# EAGLE design M7050E (EAGLE 6.6.0)
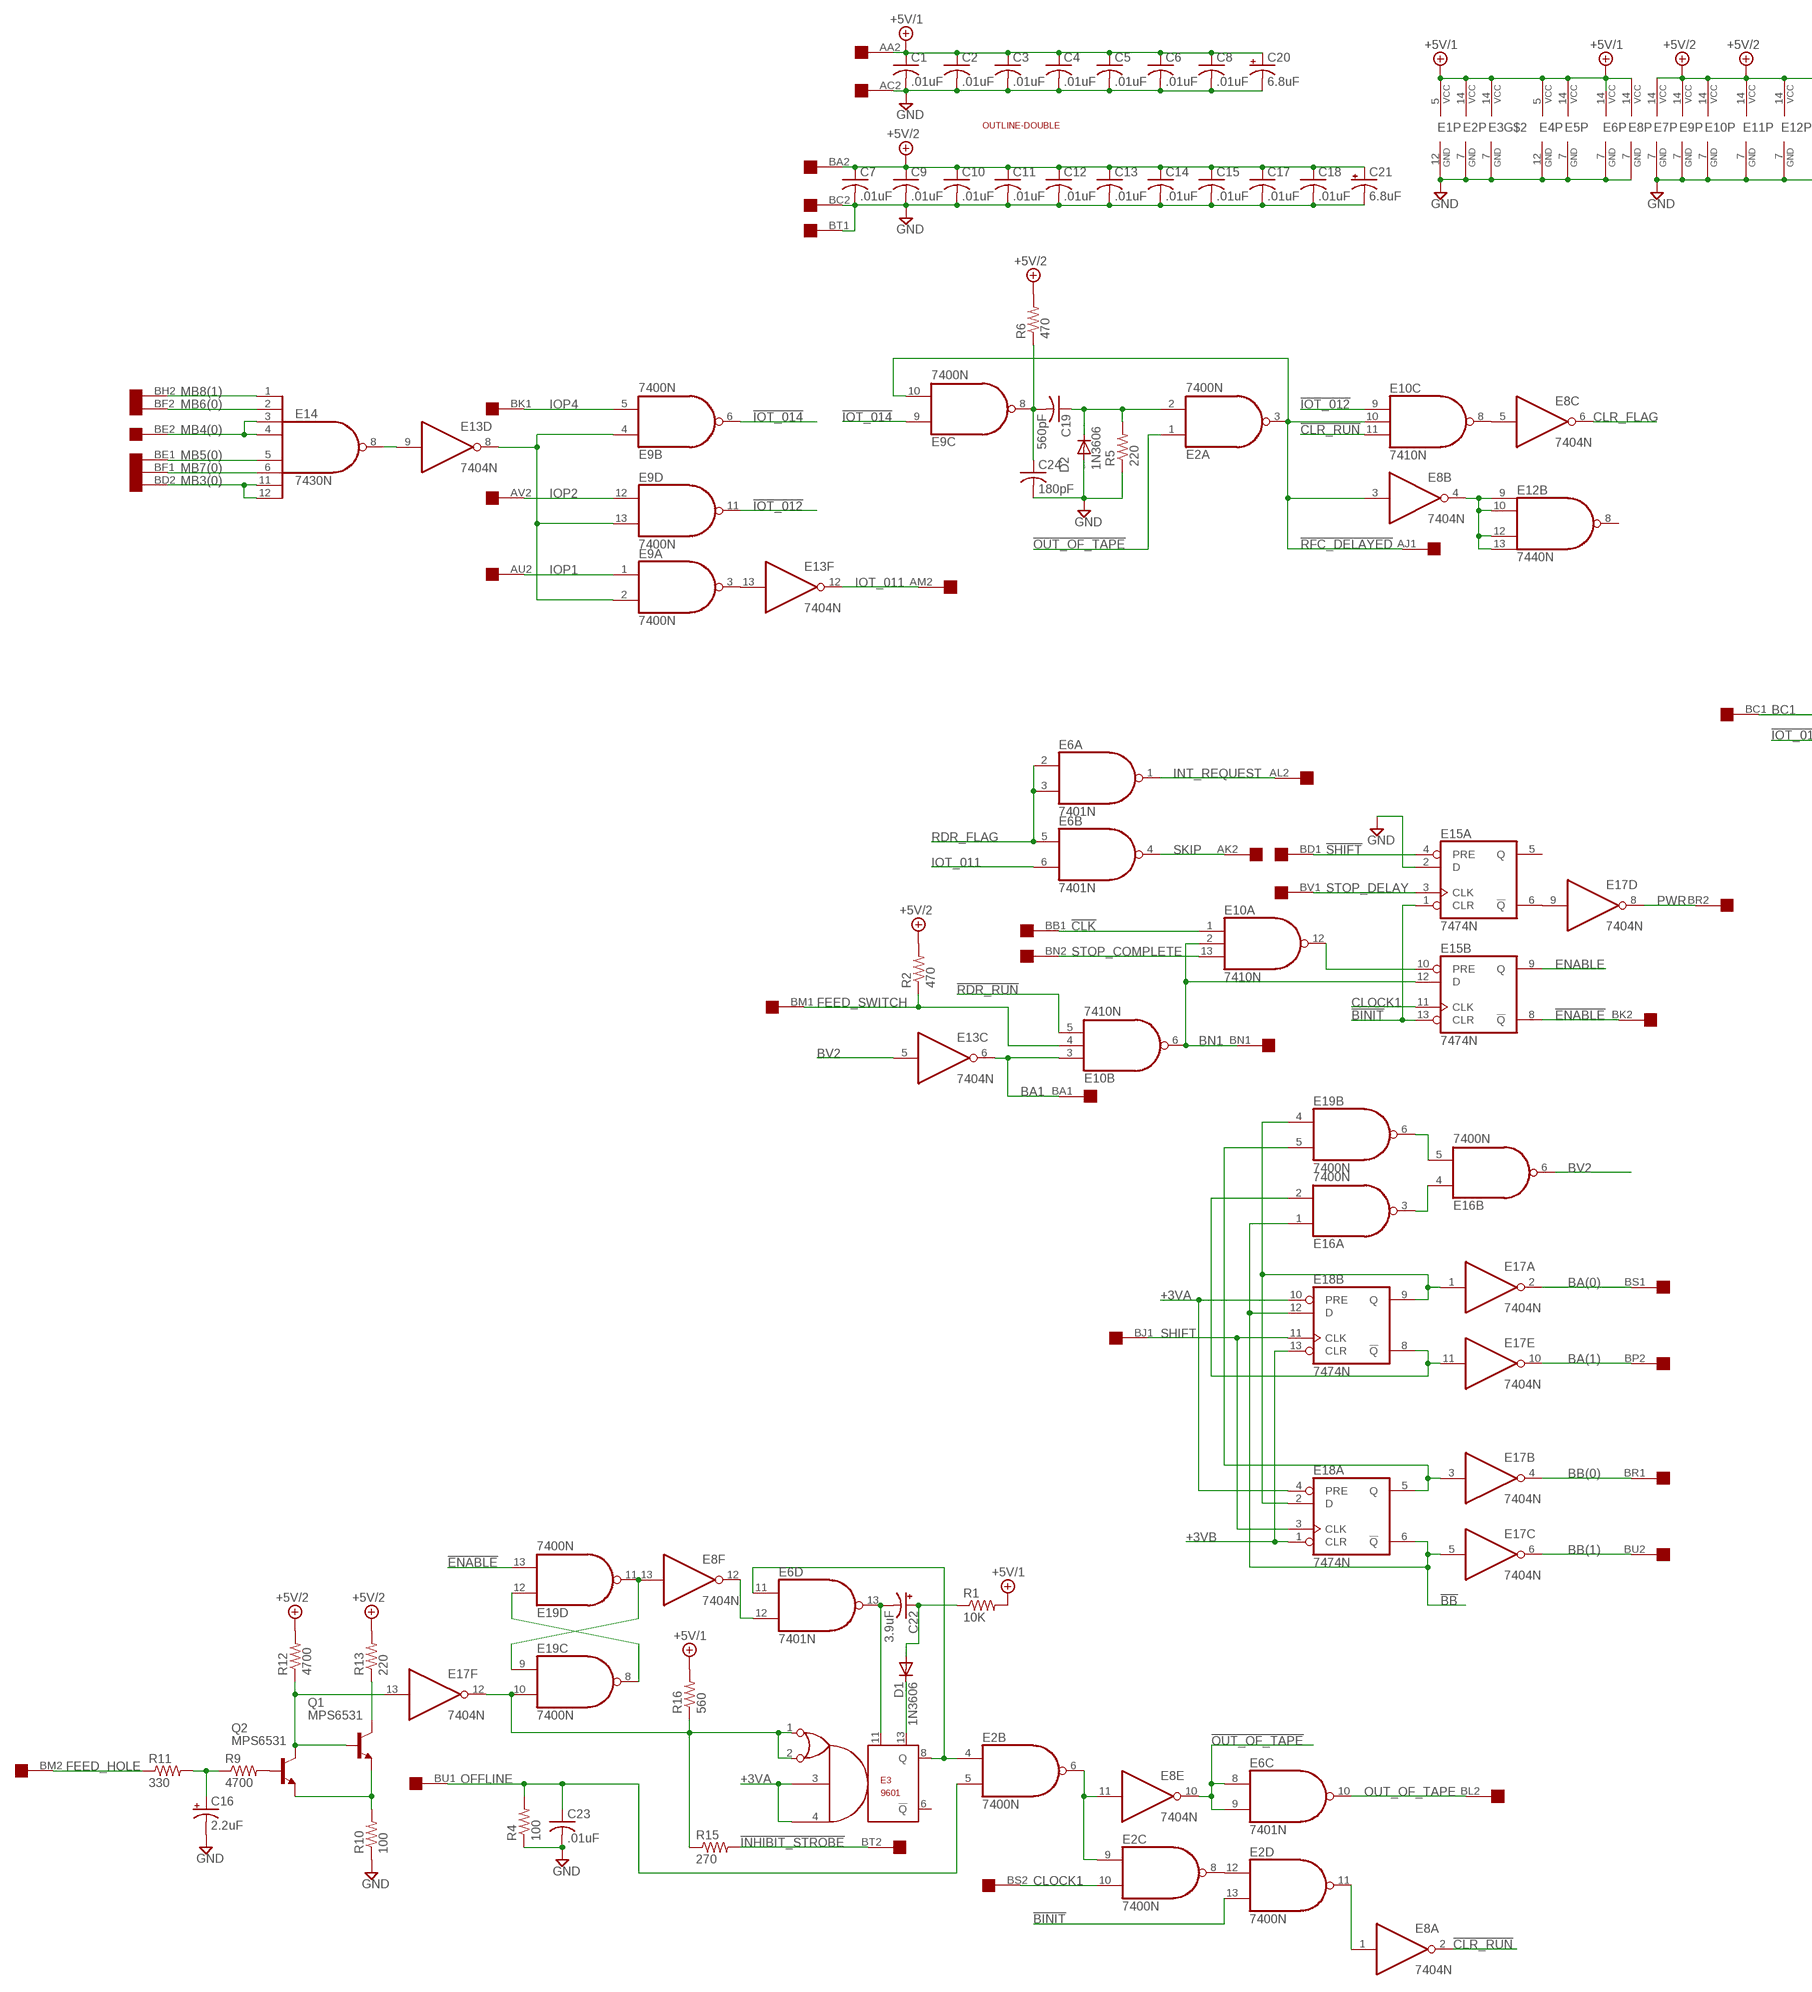
[diagram p0: schematic, sheet 1, part 1 of 2]
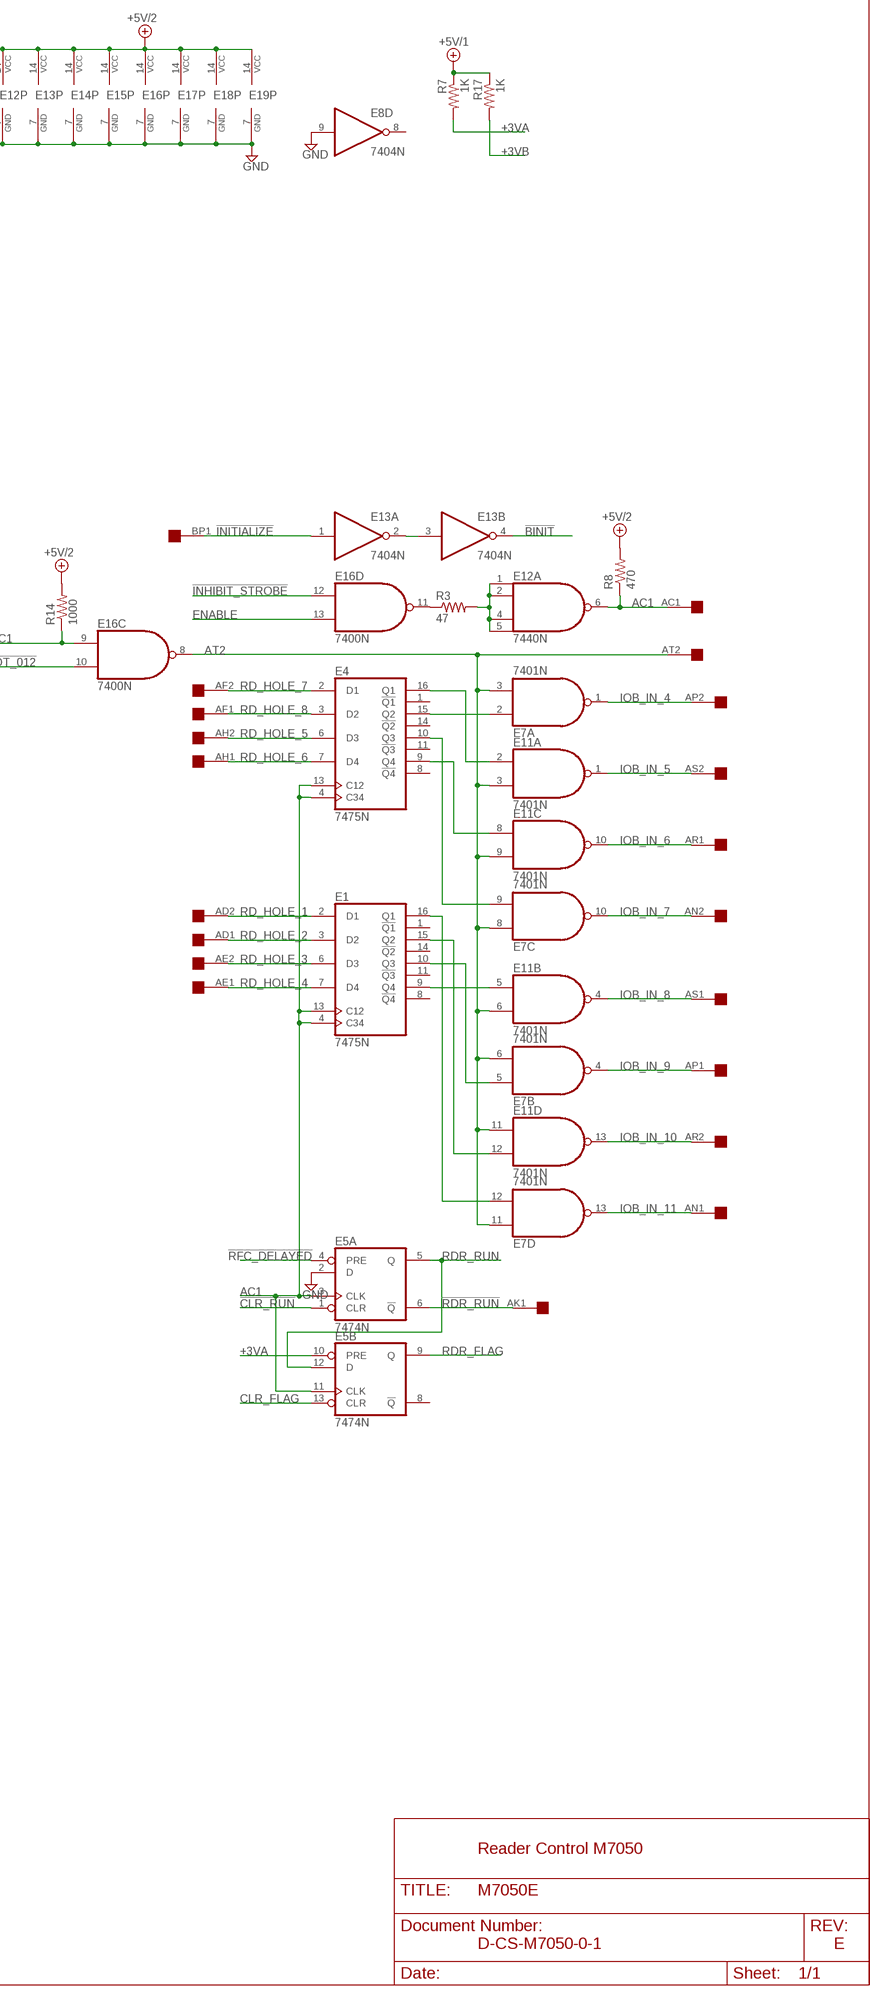
[diagram p1: schematic, sheet 1, part 2 of 2]

## Parts
C1  .01uF  C-US075-032X103  [C075-032X103]
C2  .01uF  C-US075-032X103  [C075-032X103]
C3  .01uF  C-US075-032X103  [C075-032X103]
C4  .01uF  C-US075-032X103  [C075-032X103]
C5  .01uF  C-US050-025X075  [C050-025X075]
C6  .01uF  C-US075-032X103  [C075-032X103]
C7  .01uF  C-US050-025X075  [C050-025X075]
C8  .01uF  C-US075-032X103  [C075-032X103]
C9  .01uF  C-US075-032X103  [C075-032X103]
C10  .01uF  C-US050-025X075  [C050-025X075]
C11  .01uF  C-US075-032X103  [C075-032X103]
C12  .01uF  C-US075-032X103  [C075-032X103]
C13  .01uF  C-US050-025X075  [C050-025X075]
C14  .01uF  C-US075-032X103  [C075-032X103]
C15  .01uF  C-US075-032X103  [C075-032X103]
C16  2.2uF  CPOL-USE20-8AXIAL  [E12-8]
C17  .01uF  C-US075-032X103  [C075-032X103]
C18  .01uF  C-US075-032X103  [C075-032X103]
C19  560pF  C-US050-025X075  [C050-025X075]
C20  6.8uF  CPOL-USE20-8AXIAL  [E12-8]
C21  6.8uF  CPOL-USE20-8AXIAL  [E12-8]
C22  3.9uF  CPOL-USE15-5AXIAL  [E15-5]
C23  .01uF  C-US075-032X103  [C075-032X103]
C24  180pF  C-US075-032X103  [C075-032X103]
D1  1N3606  1N4148DO35-10  [DO35-10]
D2  1N3606  1N4148DO35-10  [DO35-10]
E1  7475N  [DIL16]
E2  7400N  [DIL14]
E3  9601  [DIL14]
E4  7475N  [DIL16]
E5  7474N  74S74N  [DIL14]
E6  7401N  74LS01N  [DIL14]
E7  7401N  74LS01N  [DIL14]
E8  7404N  [DIL14]
E9  7400N  [DIL14]
E10  7410N  [DIL14]
E11  7401N  74LS01N  [DIL14]
E12  7440N  74S20N  [DIL14]
E13  7404N  [DIL14]
E14  7430N  [DIL14]
E15  7474N  74S74N  [DIL14]
E16  7400N  [DIL14]
E17  7404N  [DIL14]
E18  7474N  74S74N  [DIL14]
E19  7400N  [DIL14]
Q1  MPS6531  2N2102  [TO5]
Q2  MPS6531  2N2102  [TO5]
R1  10K  R-US_0207/10  [0207/10]
R2  470  R-US_0207/10  [0207/10]
R3  47  R-US_0207/10  [0207/10]
R4  100  R-US_0207/10  [0207/10]
R5  220  R-US_0207/10  [0207/10]
R6  470  R-US_0207/10  [0207/10]
R7  1K  R-US_0207/10  [0207/10]
R8  470  R-US_0207/10  [0207/10]
R9  4700  R-US_0207/10  [0207/10]
R10  100  R-US_0207/10  [0207/10]
R11  330  R-US_0207/10  [0207/10]
R12  4700  R-US_0207/10  [0207/10]
R13  220  R-US_0207/10  [0207/10]
R14  1000  R-US_0207/10  [0207/10]
R15  270  R-US_0207/10  [0207/10]
R16  560  R-US_0207/10  [0207/10]
R17  1K  R-US_0207/10  [0207/10]
U$5  DOUBLE  [EDGE-CON4]
U$6  OUTLINE-DOUBLE  [DOUBLE]

## Nets
!BA: E16.2(A:I1) E17.11(E:I) E18.8(B:!Q)
!BB: E16.1(A:I0) E17.5(C:I) E18.6(A:!Q) E18.12(B:D)
!BINIT: E2.13(D:I1) E13.4(B:O) E15.1(A:CLR) E15.13(B:CLR)
!CLK: E10.1(A:I0) U$5.BB1
!CLR_RUN: E5.1(A:CLR) E8.2(A:O) E10.11(C:I2)
!ENABLE: E15.8(B:!Q) E19.13(D:I1) U$5.BK2
!INHIBIT_STROBE: E16.12(D:I0) R15.2 U$5.BT2
!INITIALIZE: E13.1(A:I) U$5.BP1
!IOT_011: E9.3(A:O) E13.13(F:I)
!IOT_012: E9.11(D:O) E10.9(C:I0) E16.10(C:I1)
!IOT_014: E9.6(B:O) E9.9(C:I0)
!OUT_OF_TAPE: E2.1(A:I0) E6.8(C:I0) E6.9(C:I1) E8.10(E:O)
!RDR_RUN: E5.6(A:!Q) E10.5(B:I2) U$5.AK1
!RFC_DELAYED: E2.3(A:O) E5.4(A:PRE) E8.3(B:I) E9.10(C:I1) E10.10(C:I1) U$5.AJ1
!SHIFT: E15.4(A:PRE) U$5.BD1
+3VA: E3.3 E3.4 E5.10(B:PRE) E18.4(A:PRE) E18.10(B:PRE) R7.2
+3VB: E18.1(A:CLR) E18.13(B:CLR) R17.2
+5V/1 [Supply]: C1.1 C2.1 C3.1 C4.1 C5.1 C6.1 C8.1 C20.+ E1.5(VCC) E2.14(P:VCC) E3.14(VCC) E4.5(VCC) E5.14(P:VCC) E6.14(P:VCC) E8.14(P:VCC) R1.2 R7.1 R16.2 R17.1 U$5.AA2
+5V/2 [Supply]: C7.1 C9.1 C10.1 C11.1 C12.1 C13.1 C14.1 C15.1 C17.1 C18.1 C21.+ E7.14(P:VCC) E9.14(P:VCC) E10.14(P:VCC) E11.14(P:VCC) E12.14(P:VCC) E13.14(P:VCC) E14.14(VCC) E15.14(P:VCC) E16.14(P:VCC) E17.14(P:VCC) E18.14(P:VCC) E19.14(P:VCC) R2.2 R6.2 R8.2 R12.2 R13.2 R14.2 U$5.BA2
AC1: E1.4(C34) E1.13(C12) E4.4(C34) E4.13(C12) E5.3(A:CLK) E5.11(B:CLK) E12.6(A:O) R8.1 U$5.AC1
AT2: E7.3(A:I1) E7.6(B:I1) E7.8(C:I0) E7.11(D:I0) E11.3(A:I1) E11.6(B:I1) E11.9(C:I1) E11.11(D:I0) E16.8(C:O) U$5.AT2
BA: E17.1(A:I) E18.2(A:D) E18.9(B:Q) E19.4(B:I0)
BA1: E10.3(B:I0) E13.6(C:O) U$5.BA1
BA(0): E17.2(A:O) U$5.BS1
BA(1): E17.10(E:O) U$5.BP2
BB: E17.3(B:I) E18.5(A:Q) E19.5(B:I1)
BB(0): E17.4(B:O) U$5.BR1
BB(1): E17.6(C:O) U$5.BU2
BC1: E16.9(C:I0) R14.1 U$5.BC1
BN1: E10.2(A:I1) E10.6(B:O) E15.12(B:D) U$5.BN1
BV2: E13.5(C:I) E16.6(B:O)
CLOCK1: E2.10(C:I1) E15.11(B:CLK) U$5.BS2
CLR_FLAG: E5.13(B:CLR) E8.6(C:O)
ENABLE: E15.9(B:Q) E16.13(D:I1)
FEED_HOLE: R11.1 U$5.BM2
FEED_SWITCH: E10.4(B:I1) R2.1 U$5.BM1
GND [Supply]: C1.2 C2.2 C3.2 C4.2 C5.2 C6.2 C7.2 C8.2 C9.2 C10.2 C11.2 C12.2 C13.2 C14.2 C15.2 C16.- C17.2 C18.2 C20.- C21.- C23.2 C24.2 D2.A E1.12(GND) E2.7(P:GND) E3.7(GND) E4.12(GND) E5.2(A:D) E5.7(P:GND) E6.7(P:GND) E7.7(P:GND) E8.7(P:GND) E8.9(D:I) E9.7(P:GND) E10.7(P:GND) E11.7(P:GND) E12.7(P:GND) E13.7(P:GND) E14.7(GND) E15.2(A:D) E15.7(P:GND) E16.7(P:GND) E17.7(P:GND) E18.7(P:GND) E19.7(P:GND) R4.1 R5.1 R10.1 U$5.AC2 U$5.BC2 U$5.BT1
INT_REQUEST: E6.1(A:O) U$5.AL2
IOB_IN_4: E7.1(A:O) U$5.AP2
IOB_IN_5: E11.1(A:O) U$5.AS2
IOB_IN_6: E11.10(C:O) U$5.AR1
IOB_IN_7: E7.10(C:O) U$5.AN2
IOB_IN_8: E11.4(B:O) U$5.AS1
IOB_IN_9: E7.4(B:O) U$5.AP1
IOB_IN_10: E11.13(D:O) U$5.AR2
IOB_IN_11: E7.13(D:O) U$5.AN1
IOP1: E9.1(A:I0) U$5.AU2
IOP2: E9.12(D:I0) U$5.AV2
IOP4: E9.5(B:I1) U$5.BK1
IOT_011: E6.6(B:I1) E13.12(F:O) U$5.AM2
MB3(0): E14.11(I6) E14.12(I7) U$5.BD2
MB4(0): E14.3(I2) E14.4(I3) U$5.BE2
MB5(0): E14.5(I4) U$5.BE1
MB6(0): E14.2(I1) U$5.BF2
MB7(0): E14.6(I5) U$5.BF1
MB8(1): E14.1(I0) U$5.BH2
N$1: D1.C E3.13
N$2: E4.15(Q2) E7.2(A:I0)
N$3: E4.16(Q1) E11.2(A:I0)
N$4: C22.+ D1.A R1.1
N$5: E13.9(D:I) E14.8(O)
N$6: E2.11(D:O) E8.1(A:I)
N$8: E9.2(A:I1) E9.4(B:I0) E9.13(D:I1) E13.8(D:O)
N$9: E4.9(Q4) E11.8(C:I0)
N$10: E4.10(Q3) E7.9(C:I1)
N$11: E1.9(Q4) E11.5(B:I0)
N$12: E1.10(Q3) E7.5(B:I0)
N$13: E1.15(Q2) E11.12(D:I1)
N$14: E1.16(Q1) E7.12(D:I1)
N$16: E2.8(C:O) E2.12(D:I0)
N$17: E17.13(F:I) Q1.2(B) Q2.3(C) R12.1
N$18: Q1.3(C) R13.1
N$19: Q1.1(E) Q2.1(E) R10.2
N$20: Q2.2(B) R9.2
N$21: E3.1 E3.2 E17.12(F:O) E19.10(C:I1) R15.1 R16.1
N$22: C16.+ R9.1 R11.2
N$24: E16.5(B:I1) E19.6(B:O)
N$25: E16.3(A:O) E16.4(B:I0)
N$26: E16.11(D:O) R3.1
N$27: E15.6(A:!Q) E17.9(D:I)
N$28: E10.12(A:O) E15.10(B:PRE)
N$29: C19.2 C24.1 E9.8(C:O) R6.1
N$30: C19.1 D2.C E2.2(A:I1) R5.2
N$32: E13.2(A:O) E13.3(B:I)
N$33: E8.5(C:I) E10.8(C:O)
N$34: E2.4(B:I0) E3.8(Q) E6.11(D:I0)
N$35: E2.6(B:O) E2.9(C:I0) E8.11(E:I)
N$36: E8.4(B:O) E12.9(B:I0) E12.10(B:I1) E12.12(B:I2) E12.13(B:I3)
N$37: C22.- E3.11 E6.13(D:O)
N$38: E6.12(D:I1) E8.12(F:O)
N$39: E12.1(A:I0) E12.2(A:I1) E12.4(A:I2) E12.5(A:I3) R3.2
N$40: E8.13(F:I) E19.9(C:I0) E19.11(D:O)
N$41: E19.8(C:O) E19.12(D:I0)
OFFLINE: C23.1 E2.5(B:I1) R4.2 U$5.BU1
OUT_OF_TAPE: E6.10(C:O) U$5.BL2
PWR: E17.8(D:O) U$5.BR2
RD_HOLE_1: E1.2(D1) U$5.AD2
RD_HOLE_2: E1.3(D2) U$5.AD1
RD_HOLE_3: E1.6(D3) U$5.AE2
RD_HOLE_4: E1.7(D4) U$5.AE1
RD_HOLE_5: E4.6(D3) U$5.AH2
RD_HOLE_6: E4.7(D4) U$5.AH1
RD_HOLE_7: E4.2(D1) U$5.AF2
RD_HOLE_8: E4.3(D2) U$5.AF1
RDR_FLAG: E5.9(B:Q) E6.2(A:I0) E6.3(A:I1) E6.5(B:I0)
RDR_RUN: E5.5(A:Q) E5.12(B:D)
SHIFT: E18.3(A:CLK) E18.11(B:CLK) U$5.BJ1
SKIP: E6.4(B:O) U$5.AK2
STOP_COMPLETE: E10.13(A:I2) U$5.BN2
STOP_DELAY: E15.3(A:CLK) U$5.BV1
Unconnected: E1.1(!Q1) E1.8(!Q4) E1.11(!Q3) E1.14(!Q2) E3.6(!Q) E4.1(!Q1) E4.8(!Q4) E4.11(!Q3) E4.14(!Q2) E5.8(B:!Q) E8.8(D:O) E12.8(B:O) E13.10(E:O) E13.11(E:I) E15.5(A:Q) E19.1(A:I0) E19.2(A:I1) E19.3(A:O) U$5.AA1 U$5.AB1 U$5.AB2 U$5.AJ2 U$5.AL1 U$5.AM1 U$5.AT1 U$5.AU1 U$5.AV1 U$5.BB2 U$5.BH1 U$5.BJ2 U$5.BL1 U$5.BV2

## Notes on the sheet
- Reader Control M7050
- D-CS-M7050-0-1 | E

## Library data of the parts
C1-C15 C17-C19 C23 C24 = rcl:C-US: CAPACITOR, American symbol
C16 C20 C21 = dec-con:CPOL-USE20-8AXIAL: A 0.8 inch electrolytic.
C22 = dec-con:CPOL-USE15-5AXIAL: 0.5" veresion of an electrolytic
D1 D2 = diode:1N4148: DIODE high speed (Philips)
E1 E4 = 74xx-us:74*75: 4-bit bistable LATCH
E2 E9 E16 E19 = 74xx-us:74*00: Quad 2-input NAND gate
E3 = dec-con:9601: DEC9601 monstable
E5 E15 E18 = 74xx-us:74*74: Dual D type positive edge triggered FLIP FLOP, preset and clear
E6 E7 E11 = 74xx-us:74*01: Quad 2-input NAND gate, open collector
E8 E13 E17 = 74xx-us:74*04: Hex INVERTER
E10 = 74xx-us:74*10: Triple 3-input NAND gate
E12 = 74xx-us:74*20: Dual 4-input NAND gate
E14 = 74xx-us:74*30: 8-input NAND gate
Q1 Q2 = transistor-npn:2N2102: NPN Transistor
R1-R17 = rcl:R-US_: RESISTOR, American symbol
U$5 = dec-con:DOUBLE: Double-Height DEC board
U$6 = dec-con:OUTLINE-*: Board outlines for DEC boards.

## Net classes
1 Supply: width 0.813 mm

## Board
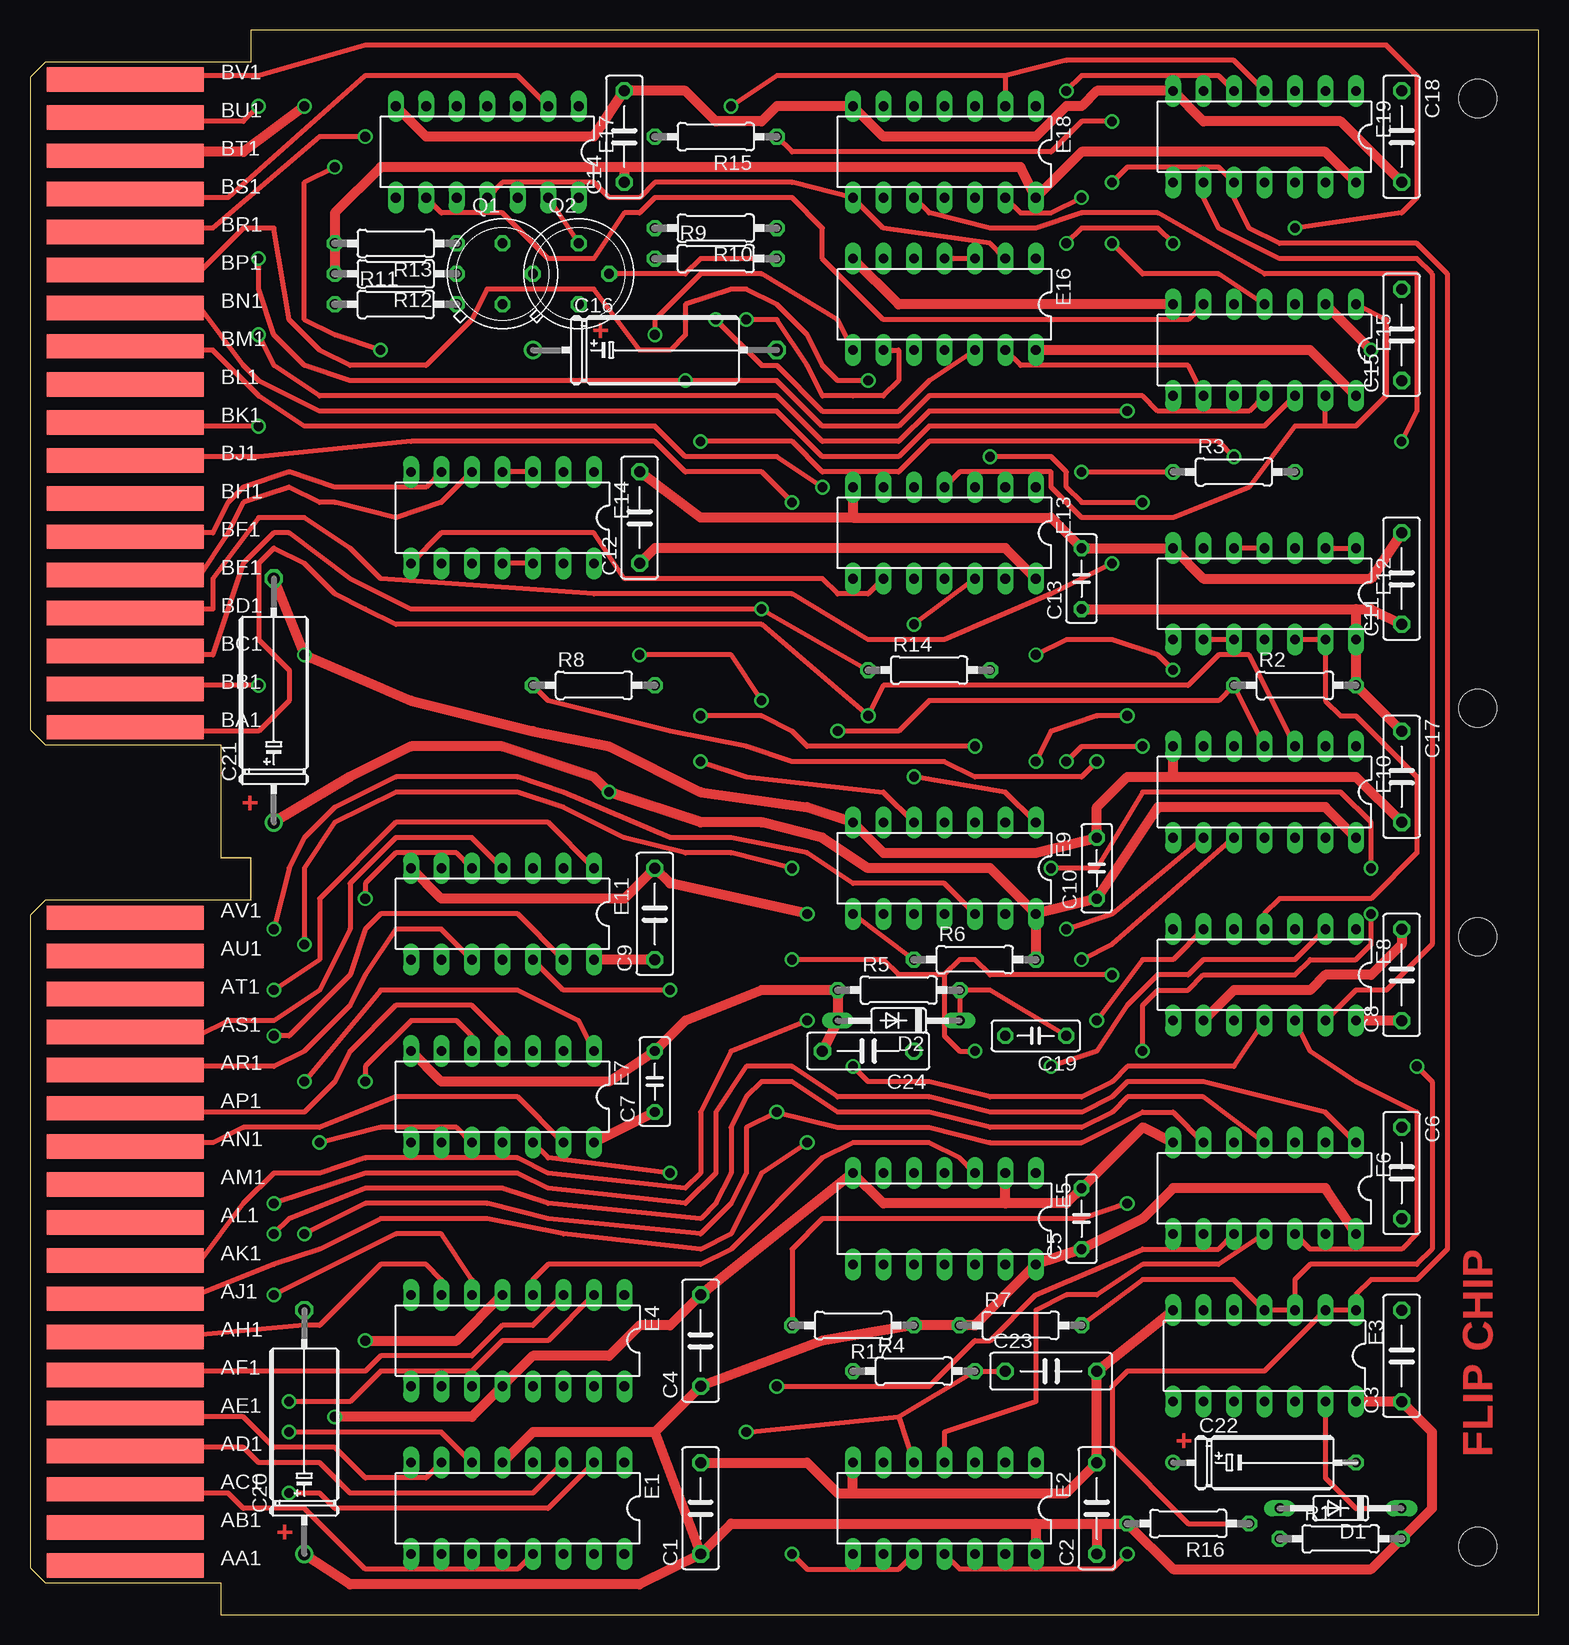
[diagram p2: board, top side]
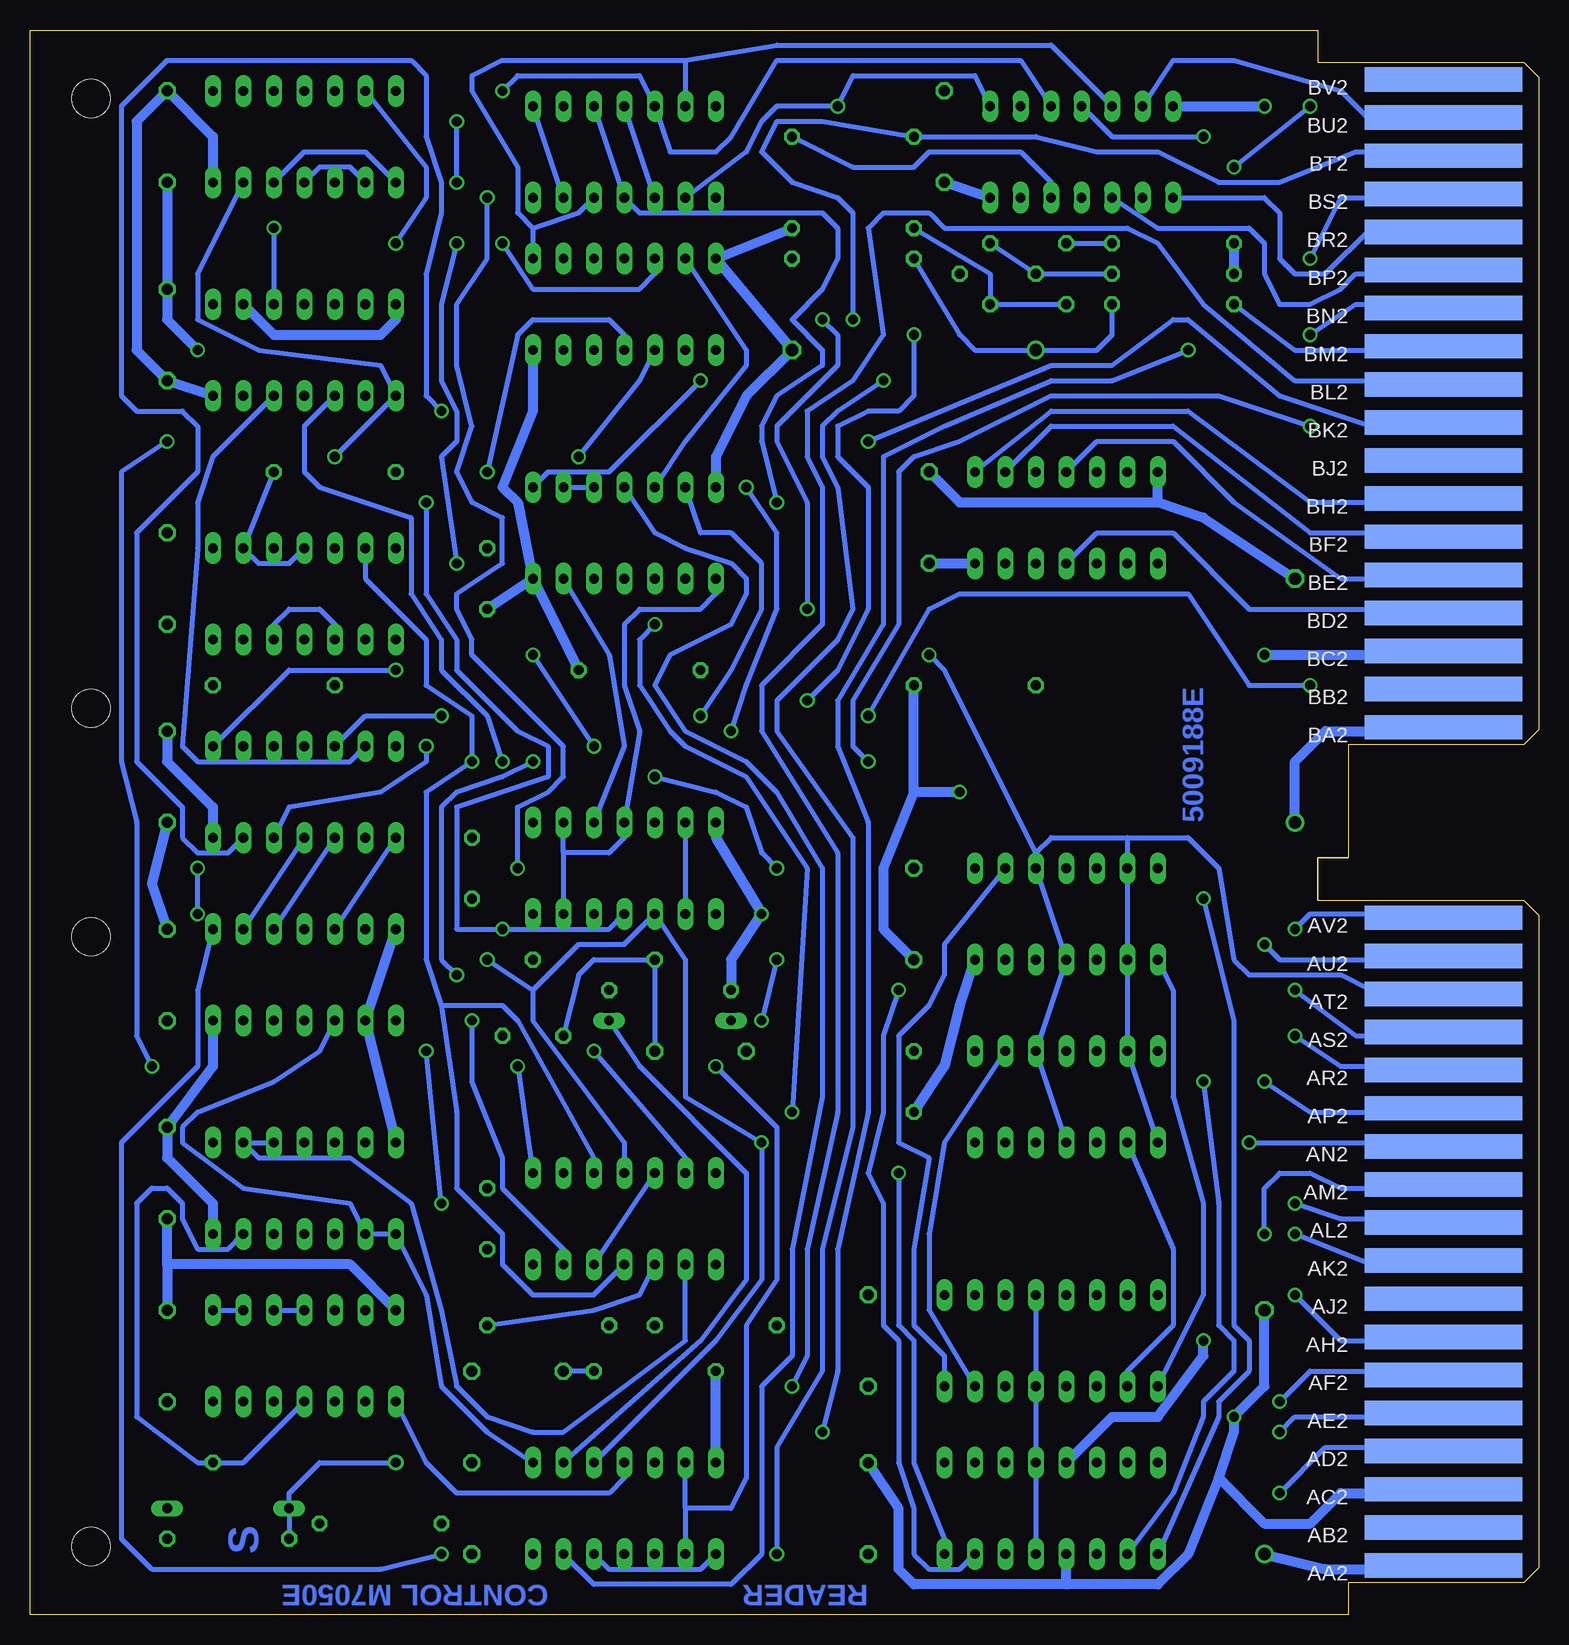
[diagram p3: board, bottom side, seen from below]

Size 125.73 x 132.08 mm. Coordinates in mm from the lower left corner, seen from the top.
Copper layers (1+16): Top 0.035mm / dielectric 1.5mm / Bottom 0.035mm
Design rules "16mils": minimum track width 16mil, minimum drill 32mil, track to track 15mil, track to pad 10mil, pad to pad 10mil, via to via 10mil, smd to smd 10mil, copper to edge 13mil, drill to drill 10mil, minimum pad ring 10mil, minimum via ring 8mil, stop-mask expansion 0mil, vias tented up to drill 0mil, thermal gap 10mil

### Footprints (pad centres in the part's own frame; a part is rotated, then mirrored left to right if it is on the bottom)
C075-032X103 = drill 0.914 octagon: 1 -3.81,0; 2 3.81,0
C050-025X075 = drill 0.813 octagon: 1 -2.54,0; 2 2.54,0
E12-8 = drill 1.016: + -10.16,0 | drill 1.016 octagon: - 10.16,0
E15-5 = drill 0.813: + -7.62,0 | drill 0.813 octagon: - 7.62,0
DO35-10 = drill 0.813 long: A 5.08,0; C -5.08,0
DIL16 = drill 0.813 long: 1 -8.89,-3.81; 2 -6.35,-3.81; 3 -3.81,-3.81; 4 -1.27,-3.81; 5 1.27,-3.81; 6 3.81,-3.81; 7 6.35,-3.81; 8 8.89,-3.81; 9 8.89,3.81; 10 6.35,3.81; 11 3.81,3.81; 12 1.27,3.81; 13 -1.27,3.81; 14 -3.81,3.81; 15 -6.35,3.81; 16 -8.89,3.81
DIL14 = drill 0.813 long: 1 -7.62,-3.81; 2 -5.08,-3.81; 3 -2.54,-3.81; 4 0,-3.81; 5 2.54,-3.81; 6 5.08,-3.81; 7 7.62,-3.81; 8 7.62,3.81; 9 5.08,3.81; 10 2.54,3.81; 11 0,3.81; 12 -2.54,3.81; 13 -5.08,3.81; 14 -7.62,3.81
TO5 = drill 0.813 octagon: 1 0,-2.54; 2 2.54,0; 3 0,2.54
0207/10 = drill 0.813 octagon: 1 -5.08,0; 2 5.08,0
EDGE-CON4 = smd 13.106 x 2.032: AA1 7.938,4.128; AB1 7.938,7.303; AC1 7.938,10.477; AD1 7.938,13.652; AE1 7.938,16.828; AF1 7.938,20.003; AH1 7.938,23.177; AJ1 7.938,26.352; AK1 7.938,29.527; AL1 7.938,32.703; AM1 7.938,35.877; AN1 7.938,39.053; AP1 7.938,42.227; AR1 7.938,45.403; AS1 7.938,48.578; AT1 7.938,51.752; AU1 7.938,54.928; AV1 7.938,58.102; BA1 7.938,73.978; BB1 7.938,77.153; BC1 7.938,80.328; BD1 7.938,83.502; BE1 7.938,86.677; BF1 7.938,89.853; BH1 7.938,93.028; BJ1 7.938,96.203; BK1 7.938,99.377; BL1 7.938,102.552; BM1 7.938,105.728; BN1 7.938,108.903; BP1 7.938,112.078; BR1 7.938,115.252; BS1 7.938,118.427; BT1 7.938,121.603; BU1 7.938,124.778; BV1 7.938,127.953 | smd 13.106 x 2.032 bottom: AA2 7.938,4.128; AB2 7.938,7.303; AC2 7.938,10.477; AD2 7.938,13.652; AE2 7.938,16.828; AF2 7.938,20.003; AH2 7.938,23.177; AJ2 7.938,26.352; AK2 7.938,29.527; AL2 7.938,32.703; AM2 7.938,35.877; AN2 7.938,39.053; AP2 7.938,42.227; AR2 7.938,45.403; AS2 7.938,48.578; AT2 7.938,51.752; AU2 7.938,54.928; AV2 7.938,58.102; BA2 7.938,73.978; BB2 7.938,77.153; BC2 7.938,80.328; BD2 7.938,83.502; BE2 7.938,86.677; BF2 7.938,89.853; BH2 7.938,93.028; BJ2 7.938,96.203; BK2 7.938,99.377; BL2 7.938,102.552; BM2 7.938,105.728; BN2 7.938,108.903; BP2 7.938,112.078; BR2 7.938,115.252; BS2 7.938,118.427; BT2 7.938,121.603; BU2 7.938,124.778; BV2 7.938,127.953
DOUBLE = hole 3.175: 120.65,56.515; 120.65,5.715; 120.65,75.565; 120.65,126.365

### Placement (x,y rotation side)
C1  55.88,8.89 90 top
C2  88.9,8.89 90 top
C3  114.3,21.59 90 top
C4  55.88,22.86 90 top
C5  87.63,33.02 90 top
C6  114.3,36.83 270 top
C7  52.07,44.45 90 top
C8  114.3,53.34 90 top
C9  52.07,58.42 90 top
C10  88.9,62.23 90 top
C11  114.3,86.36 90 top
C12  50.8,91.44 90 top
C13  87.63,86.36 90 top
C14  49.53,123.19 90 top
C15  114.3,106.68 90 top
C16  52.07,105.41 0 top
C17  114.3,69.85 270 top
C18  114.3,123.19 270 top
C19  83.82,48.26 180 top
C20  22.86,15.24 90 top
C21  20.32,76.2 90 top
C22  102.87,12.7 0 top
C23  85.09,20.32 0 top
C24  69.85,46.99 180 top
D1  109.22,8.89 180 top
D2  72.39,49.53 180 top
E1  40.64,8.89 180 top
E2  76.2,8.89 180 top
E3  102.87,21.59 180 top
E4  40.64,22.86 180 top
E5  76.2,33.02 180 top
E6  102.87,35.56 180 top
E7  39.37,43.18 180 top
E8  102.87,53.34 180 top
E9  76.2,62.23 180 top
E10  102.87,68.58 180 top
E11  39.37,58.42 180 top
E12  102.87,85.09 180 top
E13  76.2,90.17 180 top
E14  39.37,91.44 180 top
E15  102.87,105.41 180 top
E16  76.2,109.22 180 top
E17  38.1,121.92 180 top
E18  76.2,121.92 180 top
E19  102.87,123.19 180 top
Q1  39.37,111.76 0 top
Q2  45.72,111.76 0 top
R1  109.22,6.35 0 top
R2  105.41,77.47 0 top
R3  100.33,95.25 0 top
R4  73.66,20.32 0 top
R5  72.39,52.07 0 top
R6  78.74,54.61 0 top
R7  82.55,24.13 0 top
R8  46.99,77.47 0 top
R9  57.15,113.03 0 top
R10  57.15,115.57 180 top
R11  30.48,109.22 0 top
R12  30.48,111.76 180 top
R13  30.48,114.3 180 top
R14  74.93,78.74 0 top
R15  57.15,123.19 180 top
R16  96.52,7.62 180 top
R17  68.58,24.13 180 top
U$3  [FLIPCHIP]  124.46,49.53 180 top
U$5  0,0 0 top
U$6  0,0 0 top

### Tracks (layer width: path | path; a pad name or v marks a point on that pad's centre or on a via)
!BA
  Top 0.406: E17.11 39.37,119.38 46.99,119.38 48.26,118.11 50.8,118.11 52.07,119.38 63.5,119.38 E18.8 71.12,115.57 80.01,114.3 E16.2
!BB
  Bottom 0.406: E17.5 40.64,130.81 63.5,130.81 71.12,129.54 | 71.12,129.54 E18.6 | 83.82,115.57 E16.1 | 83.82,115.57 85.09,116.84 85.09,120.65 88.9,127 88.9,128.27 86.36,129.54 71.12,129.54 | 83.82,115.57 80.01,116.84 E18.12
!BINIT
  Top 0.406: E15.1 113.03,107.95 113.03,101.6 110.49,99.06 107.95,99.06 | 107.95,99.06 E15.13 | E13.4 77.47,95.25 85.09,95.25 85.09,93.98 87.63,91.44 95.25,91.44 101.6,93.98 105.41,99.06 107.95,99.06
  Bottom 0.406: E2.13 78.74,2.54 67.31,2.54 64.77,5.08 64.77,19.05 62.23,21.59 62.23,30.48 59.69,43.18 59.69,62.23 63.5,68.58 66.04,71.12 71.12,73.66 73.66,77.47 72.39,80.01 67.31,82.55 66.04,85.09 66.04,86.36 67.31,87.63 71.12,88.9 73.66,90.17 E13.4
!CLK  (via drill 0.81)
  Top 0.406: U$5.BB1 8.89,77.47 v19.05,77.47 | v78.74,72.39 64.77,72.39 63.5,73.66 60.96,74.93 v55.88,74.93 | v83.82,80.01 86.36,81.28 90.17,81.28 93.98,80.01 v95.25,78.74
  Bottom 0.406: E10.1 104.14,78.74 v95.25,78.74 | v19.05,77.47 24.13,77.47 29.21,85.09 48.26,85.09 50.8,83.82 v55.88,74.93 | v83.82,80.01 v78.74,72.39
!CLR_RUN  (via drill 0.81)
  Top 0.406: v85.09,45.72 88.9,46.99 91.44,50.8 93.98,53.34 96.52,53.34 97.79,54.61 105.41,54.61 E8.2
  Bottom 0.406: E10.11 E8.2 | v85.09,45.72 E5.1
!ENABLE  (via drill 0.81)
  Top 0.406: v100.33,96.52 99.06,97.79 74.93,97.79 72.39,95.25 66.04,95.25 63.5,97.79 v55.88,97.79
  Bottom 0.406: v100.33,96.52 E15.8 96.52,104.14 106.68,105.41 111.76,107.95 111.76,111.76 E19.13 | v55.88,97.79 40.64,104.14 35.56,104.14 30.48,107.95 29.21,107.95 21.59,101.6 13.97,99.06 8.89,99.06 U$5.BK2
!INHIBIT_STROBE  (via drill 0.81)
  Top 0.406: E16.12 74.93,102.87 72.39,100.33 66.04,100.33 62.23,104.14 60.96,104.14 v57.15,107.95
  Bottom 0.406: U$5.BT2 8.89,121.92 15.24,121.92 21.59,119.38 26.67,119.38 31.75,121.92 36.83,121.92 41.91,123.19 R15.2 59.69,124.46 63.5,124.46 64.77,121.92 62.23,119.38 58.42,118.11 57.15,116.84 v57.15,107.95
!INITIALIZE  (via drill 0.81)
  Top 0.406: v69.85,102.87 67.31,102.87 66.04,104.14 64.77,106.68 62.23,109.22 59.69,110.49 58.42,110.49 54.61,109.22 54.61,106.68 53.34,105.41 50.8,105.41 46.99,110.49 38.1,110.49 36.83,107.95 33.02,104.14 26.67,104.14 24.13,105.41 21.59,107.95 20.32,115.57 17.78,115.57 13.97,111.76 8.89,111.76 U$5.BP1
  Bottom 0.406: E13.1 82.55,95.25 77.47,95.25 v69.85,102.87
!IOT_011
  Bottom 0.406: E13.13 77.47,80.01 76.2,72.39 E9.3
!IOT_012  (via drill 0.81)
  Top 0.406: v80.01,96.52 85.09,96.52 86.36,95.25 86.36,93.98 87.63,92.71 v92.71,92.71 | E10.9 90.17,58.42 v86.36,57.15
  Bottom 0.406: v80.01,96.52 74.93,102.87 E16.10 | v92.71,92.71 92.71,85.09 90.17,81.28 90.17,78.74 85.09,73.66 82.55,72.39 82.55,69.85 90.17,67.31 90.17,57.15 v86.36,57.15 77.47,57.15 E9.11
!IOT_014
  Bottom 0.406: E9.6 E9.9
!OUT_OF_TAPE
  Bottom 0.406: E8.10 101.6,46.99 105.41,44.45 111.76,41.91 113.03,40.64 113.03,39.37 107.95,35.56 99.06,34.29 E6.9 E6.8 92.71,26.67 91.44,19.05 87.63,15.24 E2.1
!RDR_RUN  (via drill 0.81)
  Top 0.406: U$5.AK1 8.89,29.21 13.97,29.21 17.78,34.29 20.32,36.83 24.13,36.83 27.94,38.1 40.64,38.1 43.18,36.83 54.61,35.56 55.88,36.83 55.88,41.91 58.42,46.99 v64.77,49.53 | v91.44,74.93 88.9,74.93 85.09,73.66 v83.82,71.12 | v78.74,46.99 77.47,46.99 76.2,48.26 76.2,53.34 | 76.2,53.34 77.47,54.61 78.74,54.61 80.01,53.34 v90.17,53.34 | 76.2,53.34 72.39,53.34 71.12,54.61 v63.5,54.61
  Bottom 0.406: v63.5,54.61 v64.77,49.53 | E10.5 97.79,74.93 v91.44,74.93 | E5.6 71.12,38.1 v78.74,46.99 | v83.82,71.12 86.36,69.85 90.17,68.58 91.44,67.31 91.44,54.61 v90.17,53.34
!RFC_DELAYED  (via drill 0.81)
  Top 0.406: U$5.AJ1 8.89,26.67 13.97,26.67 20.32,29.21 24.13,30.48 29.21,33.02 38.1,33.02 44.45,31.75 55.88,30.48 58.42,31.75 60.96,36.83 v64.77,39.37 | E10.10 90.17,55.88 v87.63,54.61
  Bottom 0.406: E10.10 E8.3 | E2.3 68.58,22.86 64.77,27.94 v64.77,39.37 71.12,43.18 71.12,54.61 E9.10 76.2,55.88 80.01,55.88 83.82,52.07 | E5.4 76.2,39.37 83.82,49.53 83.82,52.07 | v87.63,54.61 83.82,52.07
!SHIFT  (via drill 0.81)
  Top 0.406: U$5.BD1 8.59,83.52 8.89,83.82 15.24,83.82 15.24,86.36 19.05,91.44 22.86,91.44 26.67,88.9 29.21,86.36 46.99,85.09 63.5,85.09 69.85,81.28 76.2,81.28 85.09,85.09 v90.17,87.63 | E15.4 99.06,111.76 92.71,111.76 v90.17,114.3
  Bottom 0.406: v90.17,87.63 91.44,96.52 90.17,97.79 90.17,100.33 91.44,102.87 91.44,109.22 v90.17,114.3
+3VA  (via drill 0.81)
  Top 0.406: R7.2 92.71,27.94 100.33,27.94 E3.4 E3.3 105.41,27.94 106.68,29.21 115.57,29.21 116.84,30.48 116.84,44.45 v115.57,45.72 | E18.10 74.93,116.84 80.01,115.57 83.82,115.57 87.63,116.84 93.98,116.84 102.87,111.76 115.57,111.76 115.57,100.33 v114.3,97.79
  Bottom 0.406: E18.10 E18.4 | E3.3 E3.4 | v114.3,97.79 118.11,95.25 118.11,71.12 116.84,66.04 116.84,48.26 v115.57,45.72 | E5.10 74.93,26.67 78.74,25.4 R7.2
+3VB  (via drill 0.81)
  Top 0.406: v91.44,34.29 87.63,33.02 66.04,33.02 63.5,30.48 R17.2 | v92.71,46.99 92.71,50.8 93.98,52.07 96.52,52.07 97.79,53.34 105.41,53.34 106.68,54.61 110.49,54.61 111.76,55.88 v111.76,58.42 | v111.76,62.23 111.76,66.04 109.22,68.58 92.71,68.58 88.9,62.23 v85.09,62.23 | E18.13 82.55,116.84 85.09,116.84 v87.63,118.11
  Bottom 0.406: v111.76,58.42 v111.76,62.23 | v91.44,34.29 v92.71,46.99 | v85.09,62.23 85.09,67.31 82.55,68.58 81.28,69.85 81.28,72.39 88.9,80.01 88.9,81.28 90.17,83.82 90.17,85.09 86.36,87.63 86.36,91.44 88.9,92.71 90.17,95.25 88.9,99.06 90.17,104.14 90.17,109.22 87.63,113.03 v87.63,118.11 | E18.13 E18.1
+5V/1  (via drill 0.81)
  Top 0.813: 88.9,7.62 R16.2 95.25,3.81 111.76,3.81 R1.2 116.84,8.89 116.84,15.24 C3.1 E3.14 | 88.9,7.62 C2.1 | C1.1 58.42,7.62 83.82,7.62 | 83.82,7.62 88.9,7.62 | 52.07,15.24 C4.1 66.04,22.86 R17.1 R7.1 78.74,24.13 E5.14 C5.1 92.71,33.02 95.25,35.56 107.95,35.56 E6.14 | 52.07,15.24 C1.1 | 52.07,15.24 41.91,15.24 E1.5 | 83.82,7.62 E2.14 | C20.+ 26.67,2.54 50.8,2.54 C1.1 | E4.5 35.56,22.86 v27.94,22.86 | C8.1 E8.14
  Bottom 0.813: E6.14 110.49,34.29 114.3,38.1 C6.1 110.49,45.72 E8.14 | U$5.AA2 8.49,4.21 8.89,3.81 17.78,3.81 C20.+ | E1.5 35.56,16.51 31.75,16.51 27.94,21.59 v27.94,22.86
+5V/2  (via drill 0.81)
  Top 0.813: E19.14 107.95,121.92 87.63,121.92 E18.14 82.55,120.65 49.53,120.65 | E16.14 106.68,105.41 E15.14 | R12.2 R13.2 25.4,116.84 29.21,120.65 49.53,120.65 | 49.53,120.65 C14.1 | C17.1 R2.2 E12.14 110.49,83.82 | C11.1 111.76,83.82 110.49,83.82 | C13.1 110.49,83.82 | C21.+ 26.67,69.85 31.75,72.39 39.37,72.39 46.99,69.85 v48.26,68.58 55.88,66.04 60.96,66.04 66.04,64.77 69.85,62.23 80.01,62.23 E9.14 | C9.1 E11.14 | E9.14 R6.2 | E9.14 C10.1 93.98,67.31 107.95,67.31 E10.14 | C7.1 E7.14 | C12.1 52.07,88.9 81.28,88.9 E13.14
  Bottom 0.813: E19.14 110.49,123.19 C18.1 116.84,124.46 116.84,105.41 C15.1 E15.14 | U$5.BA2 8.49,74.06 8.89,73.66 17.78,73.66 20.32,71.12 C21.+ | C12.1 E14.14 | R13.2 R12.2 | E13.14 C13.1 | E13.14 R14.2 | E13.14 85.09,92.71 86.36,93.98 83.82,100.33 E16.14 | C14.1 E17.14 | v48.26,68.58 52.07,68.58 | 52.07,68.58 R8.2 | C9.1 54.61,57.15 54.61,62.23 52.07,68.58 | C17.1 114.3,71.12 110.49,67.31 E10.14 | C7.1 49.53,45.72 48.26,50.8 E11.14
AC1  (via drill 0.81)
  Top 0.406: R8.1 43.18,76.2 53.34,73.66 59.69,72.39 63.5,71.12 76.2,71.12 78.74,69.85 87.63,69.85 v88.9,71.12 | E4.4 41.91,27.94 43.18,29.21 55.88,29.21 58.42,30.48 66.04,38.1 68.58,39.37 74.93,39.37 77.47,38.1 E5.3 | U$5.AC1 8.89,10.16 16.51,10.16 17.78,8.89 22.86,8.89 27.94,3.81 40.64,3.81 E1.13
  Bottom 0.406: E12.6 97.79,86.36 92.71,81.28 92.71,77.47 88.9,74.93 v88.9,71.12 92.71,68.58 92.71,54.61 91.44,50.8 | 91.44,50.8 86.36,50.8 85.09,49.53 78.74,38.1 E5.3 | E4.4 E4.13 E1.4 E1.13 | E5.11 78.74,26.67 83.82,26.67 86.36,29.21 86.36,31.75 90.17,35.56 90.17,41.91 91.44,50.8
AT2  (via drill 0.81)
  Top 0.406: v50.8,80.01 58.42,80.01 v60.96,76.2 | E16.8 67.31,107.95 60.96,111.76 55.88,111.76 52.07,107.95 v52.07,106.68
  Bottom 0.406: 41.91,63.5 E11.3 E11.11 E7.3 E7.11 | 41.91,63.5 40.64,64.77 34.29,64.77 | 34.29,64.77 E11.6 E11.9 E7.6 E7.8 | 34.29,64.77 29.21,64.77 26.67,62.23 25.4,54.61 24.13,53.34 16.51,53.34 13.97,52.07 8.89,52.07 U$5.AT2 | 41.91,63.5 49.53,78.74 v50.8,80.01 | v60.96,76.2 58.42,78.74 55.88,83.82 55.88,93.98 58.42,96.52 58.42,99.06 55.88,100.33 53.34,100.33 52.07,101.6 v52.07,106.68
BA  (via drill 0.81)
  Top 0.406: E19.4 100.33,129.54 86.36,129.54 81.28,128.27 | 81.28,128.27 62.23,128.27 v58.42,125.73 | 81.28,128.27 E18.2
  Bottom 0.406: E17.1 46.99,128.27 57.15,128.27 v58.42,125.73 63.5,125.73 64.77,124.46 66.04,121.92 E18.9
BA1  (via drill 0.81)
  Top 0.406: E10.3 101.6,80.01 99.06,80.01 96.52,77.47 71.12,77.47 v69.85,74.93 60.96,82.55 30.48,82.55 27.94,83.82 25.4,85.09 22.86,87.63 20.32,88.9 19.05,87.63 19.05,81.28 21.59,78.74 21.59,76.2 19.05,73.66 8.89,73.66 U$5.BA1
  Bottom 0.406: E13.6 69.85,90.17 67.31,90.17 64.77,87.63 64.77,83.82 67.31,78.74 v69.85,74.93
BA(0)
  Top 0.406: U$5.BS1 8.89,118.11 16.51,118.11 27.94,128.27 40.64,128.27 E17.2
BA(1)
  Bottom 0.406: U$5.BP2 8.89,111.76 15.24,111.76 16.51,110.49 19.05,109.22 21.59,109.22 22.86,111.76 22.86,114.3 24.13,115.57 31.75,115.57 E17.10
BB  (via drill 0.81)
  Top 0.406: E19.5 99.06,128.27 87.63,128.27 v86.36,127
  Bottom 0.406: E17.3 43.18,129.54 63.5,129.54 67.31,123.19 68.58,121.92 72.39,121.92 E18.5 74.93,128.27 85.09,128.27 v86.36,127
BB(0)  (via drill 0.81)
  Top 0.406: U$5.BR1 8.89,115.57 15.24,115.57 24.13,123.19 v27.94,123.19
  Bottom 0.406: v27.94,123.19 35.56,123.19 E17.4
BB(1)
  Bottom 0.406: U$5.BU2 8.89,124.46 13.97,124.46 16.51,127 25.4,129.54 30.48,129.54 E17.6
BC1  (via drill 0.81)
  Top 0.406: U$5.BC1 8.58,80.32 8.89,80.01 15.24,80.01 17.78,87.63 20.32,90.17 21.59,90.17 26.67,86.36 31.75,83.82 v60.96,83.82 R14.1 | E16.9 72.39,105.41 72.39,102.87 71.12,101.6 68.58,101.6 66.04,101.6 64.77,104.14 62.23,107.95 v59.69,107.95
  Bottom 0.406: v59.69,107.95 58.42,106.68 58.42,104.14 63.5,99.06 63.5,97.79 60.96,92.71 v60.96,83.82
BN1
  Top 0.406: E15.12 102.87,99.06 74.93,99.06 72.39,96.52 66.04,96.52 62.23,100.33 24.13,100.33 19.05,102.87 17.78,104.14 13.97,109.22 8.89,109.22 8.56,108.89 U$5.BN1
  Bottom 0.406: E15.12 110.49,96.52 111.76,92.71 111.76,88.9 113.03,72.39 111.76,71.12 107.95,71.12 | 107.95,71.12 E10.2 | E10.6 99.06,71.12 107.95,71.12
BV2
  Bottom 0.406: E13.5 71.12,97.79 66.04,104.14 66.04,105.41 E16.6
CLOCK1  (via drill 0.81)
  Top 0.406: E15.11 101.6,100.33 93.98,100.33 92.71,101.6 74.93,101.6 72.39,99.06 66.04,99.06 62.23,102.87 v54.61,102.87 27.94,102.87 26.67,102.87 22.86,104.14 20.32,106.68 19.05,110.49 19.05,111.76 v19.05,113.03 | v63.5,5.08 64.77,3.81 72.39,3.81 E2.10
  Bottom 0.406: U$5.BS2 8.89,118.11 16.51,118.11 v19.05,113.03 | v54.61,102.87 58.42,100.33 59.69,99.06 59.69,96.52 58.42,93.98 57.15,83.82 58.42,81.28 63.5,76.2 63.5,73.66 57.15,64.77 57.15,40.64 59.69,30.48 59.69,20.32 63.5,13.97 v63.5,5.08
CLR_FLAG  (via drill 0.81)
  Top 0.406: E8.6 95.25,54.61 92.71,54.61 v88.9,49.53
  Bottom 0.406: E5.13 81.28,30.48 86.36,35.56 86.36,38.1 88.9,44.45 v88.9,49.53
ENABLE
  Top 0.406: E16.13 82.55,104.14 96.52,104.14 E15.9
FEED_HOLE
  Bottom 0.406: U$5.BM2 8.89,105.41 20.32,105.41 R11.1
FEED_SWITCH  (via drill 0.81)
  Top 0.406: U$5.BM1 8.56,105.74 8.89,105.41 15.24,105.41 19.05,101.6 22.86,99.06 52.07,99.06 54.61,96.52 62.23,96.52 v66.04,93.98 | E10.4 R2.1 99.06,76.2 74.93,76.2 72.39,73.66 v67.31,73.66
  Bottom 0.406: v67.31,73.66 66.04,77.47 63.5,83.82 63.5,90.17 v66.04,93.98
GND  (via drill 0.81)
  Top 0.813: C18.2 109.22,124.46 97.79,124.46 E19.7 88.9,127 87.63,125.73 86.36,125.73 83.82,123.19 71.12,123.19 E18.7 62.23,125.73 60.96,124.46 57.15,124.46 54.61,127 C14.2 46.99,123.19 33.02,123.19 E17.7 | C21.- v22.86,80.01 31.75,76.2 41.91,73.66 48.26,72.39 55.88,68.58 64.77,67.31 E9.7 71.12,63.5 83.82,63.5 C10.2 88.9,67.31 91.44,69.85 95.25,69.85 | C24.2 D2.A R5.1 60.96,52.07 54.61,49.53 C7.2 48.26,44.45 34.29,44.45 E7.7 | E3.7 C23.2 C2.2 86.36,10.16 68.58,10.16 | 68.58,10.16 E2.7 | C1.2 64.77,12.7 67.31,10.16 68.58,10.16 | v111.76,105.41 E15.2 | v22.86,125.73 17.78,121.92 8.89,121.92 U$5.BT1 | E15.7 72.39,109.22 E16.7 | C11.2 111.76,86.36 97.79,86.36 E12.7 C13.2 85.09,91.44 68.58,91.44 | E8.9 100.33,52.07 106.68,52.07 107.95,53.34 111.76,53.34 114.3,55.88 C8.2 | 95.25,69.85 E10.7 | v64.77,58.42 53.34,60.96 C9.2 49.53,59.69 34.29,59.69 E11.7 | 81.28,34.29 86.36,34.29 C5.2 92.71,40.64 E6.7 | 81.28,34.29 71.12,34.29 E5.7 C4.2 53.34,24.13 50.8,24.13 48.26,21.59 41.91,21.59 E4.12 36.83,16.51 v25.4,16.51 | 81.28,34.29 E5.2 | E13.7 68.58,91.44 | 95.25,69.85 110.49,69.85 C17.2 | C12.2 55.88,91.44 68.58,91.44
  Bottom 0.813: E3.7 99.06,29.21 114.3,29.21 | 114.3,29.21 C3.2 | 114.3,29.21 C6.2 | U$5.AC2 8.56,10.49 8.89,10.16 16.51,10.16 19.05,7.62 22.86,7.62 26.67,11.43 | U$5.BC2 8.56,80.34 8.89,80.01 v22.86,80.01 | C12.2 48.26,92.71 31.75,92.71 | 31.75,92.71 E14.7 | C21.- 27.94,91.44 31.75,92.71 | E8.7 E8.9 E6.7 | E13.7 68.58,96.52 66.04,101.6 C16.- E16.7 R10.1 | C18.2 C15.2 114.3,107.95 v111.76,105.41 | E15.7 95.25,107.95 96.52,106.68 105.41,106.68 E15.2 | E9.7 68.58,64.77 v64.77,58.42 67.31,54.61 R5.1 | C20.- 22.86,19.05 v25.4,16.51 25.4,15.24 26.67,11.43 | E2.7 R4.1 | E17.7 v22.86,125.73 | C17.2 115.57,60.96 C8.2 | 39.37,2.54 E1.12 | 39.37,2.54 31.75,2.54 29.21,5.08 26.67,11.43 | C1.2 53.34,8.89 53.34,3.81 52.07,2.54 39.37,2.54
INT_REQUEST  (via drill 0.81)
  Top 0.406: v20.32,34.29 27.94,36.83 40.64,36.83 43.18,35.56 54.61,34.29 57.15,36.83 57.15,41.91 59.69,45.72 63.5,45.72 67.31,43.18 74.93,43.18 80.01,41.91 87.63,41.91 90.17,43.18 91.44,44.45 97.79,44.45 107.95,41.91 E6.1
  Bottom 0.406: U$5.AL2 8.89,33.02 16.51,33.02 v20.32,34.29
IOB_IN_4  (via drill 0.81)
  Top 0.406: E7.1 45.72,49.53 40.64,52.07 29.21,52.07 v22.86,44.45
  Bottom 0.406: U$5.AP2 8.89,41.91 19.05,41.91 v22.86,44.45
IOB_IN_5  (via drill 0.81)
  Top 0.406: v20.32,52.07 24.13,54.61 24.13,59.69 30.48,66.04 43.18,66.04 E11.1
  Bottom 0.406: U$5.AS2 8.89,48.26 15.24,48.26 v20.32,52.07
IOB_IN_6
  Top 0.406: E11.10 34.29,57.15 30.48,57.15 27.94,53.34 26.67,50.8 22.86,46.99 20.32,45.72 8.89,45.72 U$5.AR1
IOB_IN_7  (via drill 0.81)
  Top 0.406: E7.10 35.56,40.64 29.21,40.64 v24.13,39.37
  Bottom 0.406: U$5.AN2 8.89,39.37 v24.13,39.37
IOB_IN_8
  Top 0.406: E11.4 36.83,64.77 30.48,64.77 26.67,60.96 26.67,57.15 24.13,52.07 20.32,49.53 16.51,49.53 13.97,48.26 8.89,48.26 U$5.AS1
IOB_IN_9
  Top 0.406: E7.4 39.37,48.26 36.83,50.8 30.48,50.8 26.67,46.99 25.4,44.45 22.86,41.91 10.16,41.91 U$5.AP1
IOB_IN_10  (via drill 0.81)
  Top 0.406: E11.13 40.64,58.42 29.21,58.42 27.94,57.15 26.67,53.34 21.59,48.26 v20.32,48.26
  Bottom 0.406: U$5.AR2 8.89,45.72 16.51,45.72 v20.32,48.26
IOB_IN_11
  Top 0.406: E7.13 40.64,43.18 30.48,43.18 24.13,40.64 17.78,40.64 15.24,39.37 8.89,39.37 U$5.AN1
IOP1  (via drill 0.81)
  Top 0.406: v22.86,55.88 22.86,62.23 25.4,66.04 30.48,68.58 40.64,68.58 44.45,67.31 49.53,64.77 54.61,63.5 58.42,63.5 v63.5,62.23 | E9.1 81.28,68.58 v73.66,69.85
  Bottom 0.406: U$5.AU2 8.89,54.61 21.59,54.61 v22.86,55.88 | v73.66,69.85 68.58,68.58 66.04,67.31 64.77,63.5 v63.5,62.23
IOP2  (via drill 0.81)
  Top 0.406: v20.32,57.15 21.59,62.23 22.86,64.77 25.4,67.31 30.48,69.85 40.64,69.85 44.45,68.58 53.34,64.77 58.42,64.77 64.77,63.5 68.58,60.96 76.2,60.96 E9.12
  Bottom 0.406: U$5.AV2 8.89,58.42 19.05,58.42 v20.32,57.15
IOP4  (via drill 0.81)
  Top 0.406: U$5.BK1 8.59,99.36 8.89,99.06 v19.05,99.06 | E9.5 71.12,68.58 59.69,69.85 v55.88,71.12
  Bottom 0.406: v19.05,99.06 26.67,101.6 40.64,101.6 48.26,97.79 52.07,96.52 53.34,95.25 53.34,82.55 57.15,76.2 57.15,72.39 v55.88,71.12
IOT_011  (via drill 0.81)
  Top 0.406: v22.86,31.75 27.94,34.29 38.1,34.29 43.18,33.02 55.88,31.75 58.42,34.29 59.69,36.83 59.69,40.64 v62.23,41.91 67.31,40.64 74.93,40.64 80.01,39.37 87.63,39.37 92.71,41.91 95.25,41.91 E6.6 | E13.12 v73.66,82.55
  Bottom 0.406: U$5.AM2 8.89,35.56 16.51,35.56 19.05,36.83 21.59,36.83 22.86,35.56 v22.86,31.75 | v62.23,41.91 60.96,62.23 66.04,69.85 71.12,72.39 72.39,73.66 74.93,77.47 74.93,81.28 v73.66,82.55
MB3(0)
  Top 0.406: E14.12 E14.11
  Bottom 0.406: U$5.BD2 8.59,83.52 8.89,83.82 24.13,83.82 30.48,90.17 36.83,90.17 E14.11
MB4(0)
  Top 0.406: E14.3 E14.4
  Bottom 0.406: E14.4 36.83,97.79 30.48,97.79 25.4,92.71 16.51,86.36 8.89,86.36 8.56,86.69 U$5.BE2
MB5(0)
  Top 0.406: U$5.BE1 8.56,86.69 8.89,86.36 13.97,86.36 16.51,90.17 17.78,92.71 21.59,93.98 24.13,92.71 25.4,92.71 30.48,91.44 34.29,92.71 E14.5
MB6(0)
  Bottom 0.406: E14.2 40.64,99.06 30.48,99.06 19.05,90.17 8.89,90.17 8.61,89.89 U$5.BF2
MB7(0)
  Top 0.406: U$5.BF1 8.61,89.89 8.89,90.17 15.24,90.17 16.51,92.71 17.78,93.98 21.59,95.25 25.4,93.98 33.02,93.98 E14.6
MB8(1)
  Bottom 0.406: E14.1 40.64,100.33 29.21,100.33 19.05,92.71 8.89,92.71 8.56,93.04 U$5.BH2
N$1
  Top 0.406: D1.C 110.49,8.89 107.95,11.43 E3.13
N$2
  Bottom 0.406: E7.2 49.53,39.37 50.8,31.75 50.8,25.4 E4.15
N$3
  Bottom 0.406: E11.2 49.53,55.88 49.53,53.34 50.8,50.8 53.34,48.26 53.34,39.37 50.8,38.1 52.07,30.48 52.07,24.13 49.53,21.59 E4.16
N$4
  Bottom 0.406: R1.1 D1.A 104.14,10.16 101.6,12.7 C22.+
N$5
  Top 0.406: E13.9 69.85,85.09 67.31,85.09 66.04,86.36 49.53,86.36 46.99,90.17 34.29,90.17 E14.8
N$6  (via drill 0.81)
  Top 0.406: E2.11 77.47,3.81 90.17,3.81 v91.44,5.08
  Bottom 0.406: v91.44,5.08 96.52,3.81 115.57,3.81 118.11,6.35 118.11,39.37 111.76,45.72 111.76,52.07 E8.1
N$8
  Bottom 0.406: 81.28,63.5 E9.2 | 81.28,63.5 E9.13 | 81.28,63.5 77.47,63.5 76.2,64.77 E9.4 74.93,73.66 76.2,77.47 76.2,82.55 74.93,83.82 69.85,83.82 68.58,85.09 E13.8
N$9
  Bottom 0.406: E4.9 27.94,26.67 27.94,34.29 30.48,43.18 30.48,52.07 E11.8
N$10
  Bottom 0.406: E4.10 34.29,20.32 30.48,24.13 30.48,30.48 E7.9
N$11  (via drill 0.81)
  Top 0.406: E11.5 35.56,63.5 30.48,63.5 27.94,60.96 v27.94,59.69
  Bottom 0.406: v27.94,59.69 25.4,49.53 25.4,24.13 24.13,22.86 24.13,20.32 26.67,17.78 26.67,16.51 E1.9
N$12  (via drill 0.81)
  Top 0.406: E7.5 36.83,48.26 35.56,49.53 31.75,49.53 27.94,45.72 v27.94,44.45
  Bottom 0.406: v27.94,44.45 26.67,34.29 26.67,24.13 25.4,22.86 25.4,20.32 27.94,17.78 27.94,16.51 30.48,10.16 E1.10
N$13  (via drill 0.81)
  Top 0.406: v53.34,52.07 44.45,52.07 E11.12
  Bottom 0.406: E1.15 48.26,3.81 50.8,3.81 52.07,5.08 52.07,8.89 53.34,12.7 53.34,22.86 54.61,24.13 54.61,34.29 55.88,36.83 54.61,41.91 54.61,48.26 v53.34,52.07
N$14  (via drill 0.81)
  Top 0.406: v53.34,36.83 43.18,38.1 E7.12
  Bottom 0.406: E1.16 49.53,6.35 52.07,12.7 52.07,22.86 53.34,24.13 v53.34,36.83
N$16
  Bottom 0.406: E2.12 77.47,3.81 69.85,3.81 E2.8
N$17
  Top 0.406: E17.13 Q2.3
  Bottom 0.406: R12.1 Q1.2 Q2.3
N$18
  Bottom 0.406: Q1.3 R13.1
N$19
  Bottom 0.406: R10.2 45.72,111.76 Q2.1 Q1.1
N$20
  Top 0.406: R9.2 55.88,113.03 54.61,111.76 Q2.2
N$21  (via drill 0.81)
  Top 0.406: R16.1 96.52,7.62 90.17,13.97 90.17,19.05 91.44,20.32 102.87,20.32 E3.2 E3.1 110.49,26.67 111.76,27.94 115.57,27.94 118.11,30.48 118.11,111.76 115.57,114.3 104.14,114.3 101.6,115.57 100.33,118.11 E19.10 99.06,120.65 91.44,120.65 v90.17,119.38 | v90.17,124.46 87.63,124.46 85.09,121.92 63.5,121.92 R15.1
  Bottom 0.406: E3.1 E3.2 | E17.12 40.64,119.38 43.18,121.92 50.8,121.92 52.07,120.65 57.15,120.65 R15.1 | v90.17,119.38 v90.17,124.46
N$22
  Bottom 0.406: R9.1 48.26,106.68 46.99,105.41 C16.+ 36.83,105.41 35.56,106.68 R11.2
N$24  (via drill 0.81)
  Top 0.406: v86.36,114.3 87.63,115.57 93.98,115.57 v95.25,114.3
  Bottom 0.406: E16.5 73.66,111.76 74.93,110.49 83.82,110.49 v86.36,114.3 | E19.6 92.71,120.65 92.71,118.11 v95.25,114.3
N$25
  Top 0.406: E16.3 E16.4
N$26  (via drill 0.81)
  Top 0.406: v87.63,95.25 R3.1
  Bottom 0.406: E16.11 76.2,106.68 77.47,107.95 83.82,107.95 85.09,106.68 v87.63,95.25
N$27
  Top 0.406: E17.9 34.29,116.84 39.37,116.84 43.18,113.03 46.99,113.03 49.53,116.84 50.8,116.84 52.07,118.11 63.5,118.11 66.04,115.57 66.04,113.03 71.12,107.95 96.52,107.95 E15.6
N$28  (via drill 0.81)
  Top 0.406: v92.71,72.39 87.63,72.39 v86.36,71.12
  Bottom 0.406: E15.10 102.87,99.06 102.87,95.25 101.6,93.98 93.98,91.44 93.98,85.09 91.44,81.28 91.44,78.74 87.63,74.93 v86.36,71.12 | E10.12 104.14,67.31 96.52,68.58 92.71,71.12 v92.71,72.39
N$29
  Top 0.406: R6.1 E9.8
  Bottom 0.406: C19.2 80.01,53.34 78.74,54.61 R6.1 C24.1
N$30
  Top 0.406: D2.C R5.2 80.01,52.07 C19.1
  Bottom 0.406: E2.2 69.85,22.86 66.04,27.94 66.04,36.83 74.93,45.72 D2.C
N$32
  Bottom 0.406: E13.2 E13.3
N$33
  Bottom 0.406: E10.8 E8.5
N$34
  Top 0.406: E6.11 99.06,29.21 92.71,29.21 88.9,26.67 86.36,26.67 83.82,25.4 83.82,17.78 76.2,15.24 E2.4
  Bottom 0.406: E3.8 92.71,12.7 90.17,10.16 77.47,10.16 76.2,11.43 E2.4
N$35  (via drill 0.81)
  Top 0.406: E8.11 100.33,45.72 91.44,45.72 90.17,44.45 87.63,43.18 80.01,43.18 74.93,44.45 69.85,44.45 v68.58,45.72
  Bottom 0.406: 71.12,8.89 E2.6 | 71.12,8.89 E2.9 | 71.12,8.89 67.31,8.89 66.04,11.43 66.04,24.13 63.5,27.94 63.5,40.64 v68.58,45.72
N$36
  Top 0.406: E12.10 E12.9 | E12.12 E12.13 107.95,76.2 109.22,74.93 110.49,74.93 115.57,69.85 115.57,63.5 111.76,59.69 104.14,59.69 102.87,58.42 E8.4
  Bottom 0.406: E12.12 105.41,82.55 104.14,83.82 101.6,83.82 100.33,82.55 E12.10
N$37
  Bottom 0.406: E3.11 107.95,12.7 C22.- 111.76,12.7 116.84,16.51 116.84,34.29 115.57,35.56 114.3,35.56 113.03,34.29 113.03,33.02 111.76,30.48 109.22,30.48 E6.13
N$38
  Top 0.406: E6.12 106.68,30.48 114.3,30.48 115.57,31.75 115.57,41.91 110.49,44.45 106.68,46.99 E8.12
N$39
  Top 0.406: E12.2 E12.1 | E12.4 E12.5
  Bottom 0.406: R3.2 E12.2 106.68,87.63 104.14,87.63 E12.4
N$40
  Top 0.406: E19.9 97.79,118.11 99.06,115.57 104.14,113.03 115.57,113.03 116.84,111.76 116.84,55.88 113.03,52.07 110.49,52.07 E8.13
  Bottom 0.406: E19.11 101.6,120.65 99.06,120.65 E19.9
N$41
  Bottom 0.406: E19.12 102.87,121.92 97.79,121.92 E19.8
OFFLINE  (via drill 0.81)
  Top 0.406: C23.1 R4.2 72.39,16.51 | 72.39,16.51 E2.5 | v59.69,15.24 72.39,16.51 | U$5.BU1 8.89,124.46 17.78,124.46 v19.05,125.73 | v25.4,120.65 22.86,119.38 22.86,107.95 25.4,106.68 v29.21,105.41
  Bottom 0.406: R4.2 C23.1 | v25.4,120.65 v19.05,125.73 | v29.21,105.41 35.56,102.87 40.64,102.87 49.53,99.06 54.61,96.52 54.61,82.55 58.42,76.2 58.42,72.39 55.88,66.04 55.88,41.91 58.42,30.48 58.42,20.32 v59.69,15.24
OUT_OF_TAPE  (via drill 0.81)
  Top 0.406: E6.10 99.06,30.48 92.71,30.48 83.82,26.67 80.01,22.86 78.74,22.86 74.93,19.05 v62.23,19.05
  Bottom 0.406: U$5.BL2 8.89,102.87 20.32,102.87 27.94,109.22 31.75,114.3 34.29,115.57 49.53,115.57 50.8,116.84 54.61,116.84 55.88,115.57 54.61,106.68 57.15,102.87 60.96,100.33 60.96,96.52 59.69,93.98 59.69,82.55 64.77,77.47 64.77,73.66 58.42,63.5 58.42,41.91 60.96,30.48 60.96,21.59 v62.23,19.05
PWR
  Bottom 0.406: U$5.BR2 8.89,115.57 13.97,115.57 17.78,111.76 20.32,111.76 21.59,113.03 21.59,116.84 22.86,118.11 E17.8
RD_HOLE_1  (via drill 0.81)
  Top 0.406: E1.2 43.18,8.89 25.4,8.89 24.13,10.16 v21.59,10.16
  Bottom 0.406: U$5.AD2 8.59,13.66 8.89,13.97 17.78,13.97 v21.59,10.16
RD_HOLE_2
  Top 0.406: E1.3 41.91,10.16 26.67,10.16 24.13,12.7 19.05,12.7 17.78,13.97 8.89,13.97 U$5.AD1
RD_HOLE_3  (via drill 0.81)
  Top 0.406: E1.6 34.29,15.24 v21.59,15.24
  Bottom 0.406: U$5.AE2 8.56,16.84 8.89,16.51 20.32,16.51 v21.59,15.24
RD_HOLE_4
  Top 0.406: E1.7 33.02,11.43 27.94,11.43 25.4,13.97 20.32,13.97 17.78,16.51 10.16,16.51 U$5.AE1
RD_HOLE_5  (via drill 0.81)
  Top 0.406: v20.32,26.67 30.48,31.75 34.29,31.75 36.83,27.94 E4.6
  Bottom 0.406: U$5.AH2 8.89,22.86 16.51,22.86 v20.32,26.67
RD_HOLE_6
  Top 0.406: U$5.AH1 8.89,22.86 22.86,24.13 24.13,24.13 29.21,29.21 33.02,29.21 34.29,27.94 E4.7
RD_HOLE_7  (via drill 0.81)
  Top 0.406: E4.2 43.18,22.86 39.37,22.86 36.83,20.32 29.21,20.32 26.67,17.78 v21.59,17.78
  Bottom 0.406: U$5.AF2 8.61,20.04 8.89,20.32 19.05,20.32 v21.59,17.78
RD_HOLE_8
  Top 0.406: E4.3 41.91,24.13 39.37,24.13 36.83,21.59 29.21,21.59 27.94,20.32 8.89,20.32 U$5.AF1
RDR_FLAG
  Bottom 0.406: 100.33,38.1 106.68,38.1 E6.2 E6.3 | 100.33,38.1 E6.5 | 100.33,38.1 99.06,38.1 93.98,34.29 91.44,25.4 90.17,19.05 87.63,16.51 83.82,15.24 81.28,15.24 71.12,22.86 E5.9
RDR_RUN
  Bottom 0.406: E5.5 E5.12
SHIFT  (via drill 0.81)
  Top 0.406: U$5.BJ1 8.89,96.52 19.05,96.52 31.75,97.79 52.07,97.79 54.61,95.25 60.96,95.25 v63.5,92.71
  Bottom 0.406: E18.3 E18.11 74.93,116.84 59.69,116.84 58.42,115.57 58.42,113.03 59.69,110.49 62.23,107.95 59.69,105.41 59.69,104.14 63.5,101.6 64.77,99.06 64.77,97.79 v63.5,92.71
SKIP  (via drill 0.81)
  Top 0.406: v20.32,31.75 21.59,33.02 27.94,35.56 39.37,35.56 43.18,34.29 55.88,33.02 57.15,34.29 58.42,36.83 58.42,40.64 59.69,43.18 60.96,44.45 63.5,44.45 67.31,41.91 74.93,41.91 80.01,40.64 87.63,40.64 90.17,41.91 91.44,43.18 97.79,43.18 E6.4
  Bottom 0.406: U$5.AK2 8.89,29.21 13.97,29.21 v20.32,31.75
STOP_COMPLETE  (via drill 0.81)
  Top 0.406: v91.44,100.33 74.93,100.33 72.39,97.79 66.04,97.79 62.23,101.6 24.13,101.6 20.32,104.14 v19.05,106.68
  Bottom 0.406: E10.13 109.22,63.5 111.76,63.5 113.03,64.77 113.03,67.31 116.84,71.12 116.84,90.17 111.76,95.25 111.76,99.06 113.03,100.33 116.84,100.33 118.11,101.6 118.11,125.73 114.3,129.54 93.98,129.54 92.71,128.27 92.71,123.19 91.44,119.38 91.44,116.84 92.71,111.76 92.71,101.6 v91.44,100.33 | U$5.BN2 8.89,109.22 15.24,109.22 v19.05,106.68
STOP_DELAY  (via drill 0.81)
  Top 0.406: U$5.BV1 8.89,128.27 19.05,128.27 27.94,130.81 113.03,130.81 115.57,128.27 115.57,118.11 114.3,116.84 v105.41,115.57
  Bottom 0.406: v105.41,115.57 E15.3

### Text on the board
Top: + | + | + | +
Bottom: 5009188E | S | READER | CONTROL M7050E